# Altium schematic sheet LED_POWER.SchDoc
size A; SheetNumber: 1; SheetTotal: 1
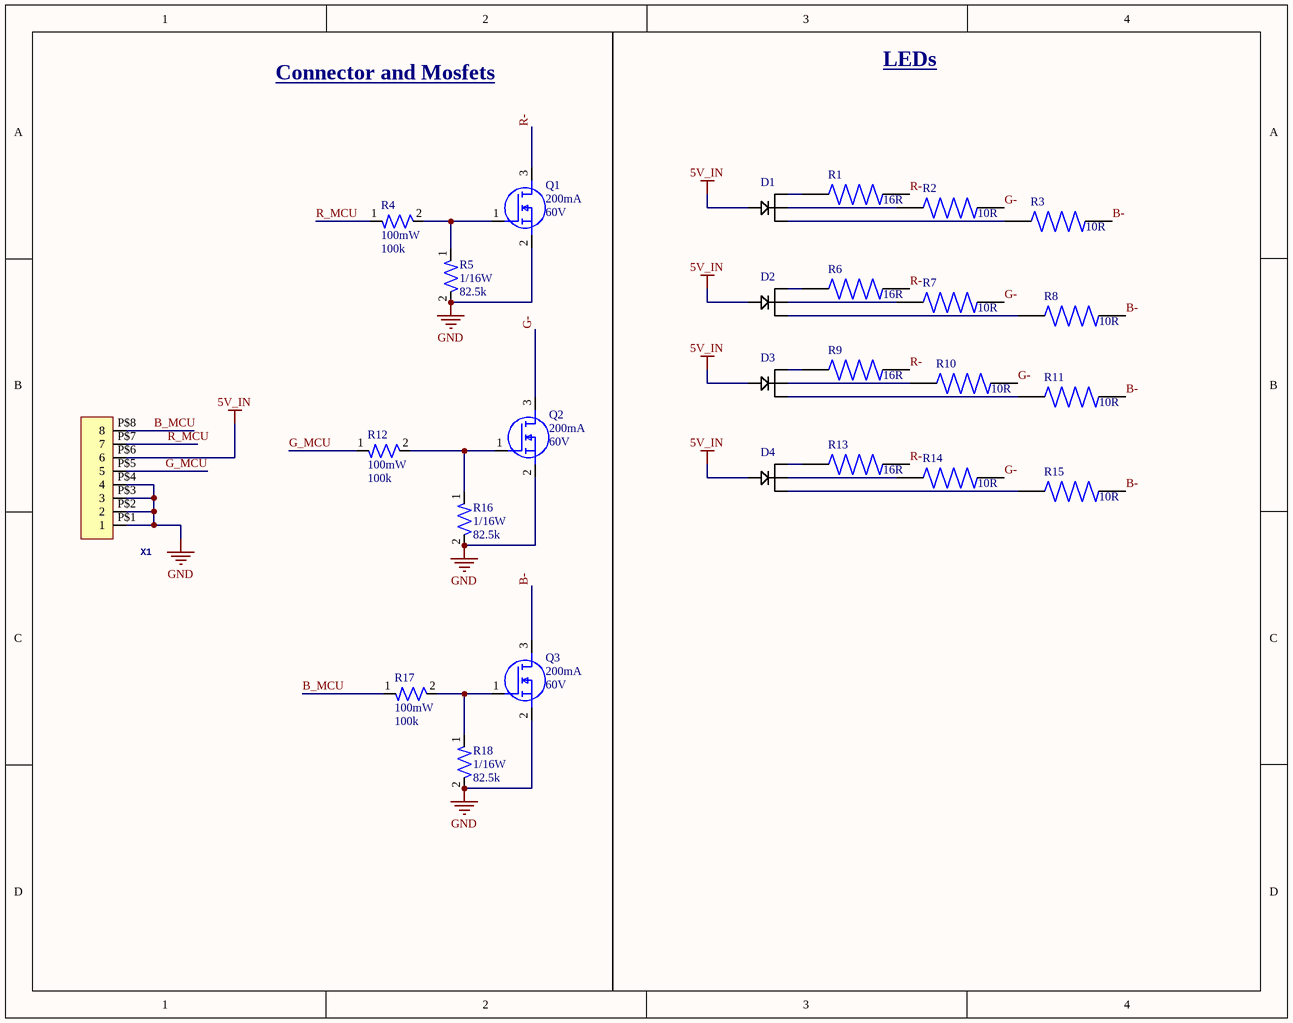
[diagram p0: LED_POWER.SchDoc]

## Parts
D1  FD-9RGB-Y2  [RGBLED pcb]  (value not drawn)
D2  FD-9RGB-Y2  [RGBLED pcb]  (value not drawn)
D3  FD-9RGB-Y2  [RGBLED pcb]  (value not drawn)
D4  FD-9RGB-Y2  [RGBLED pcb]  (value not drawn)
Q1  Continuous Current: 200mA  Voltage: 60V  [IC-SOT23-3]  (hidden comment: T2N7002AK,LM)
Q2  Continuous Current: 200mA  Voltage: 60V  [IC-SOT23-3]  (hidden comment: T2N7002AK,LM)
Q3  Continuous Current: 200mA  Voltage: 60V  [IC-SOT23-3]  (hidden comment: T2N7002AK,LM)
R1  Resistance: 16R  [RES-2512]  (hidden comment: 352116RFT)
R2  Resistance: 10R  [RES-1206]  (hidden comment: CRCW120610R0FKEAHP)
R3  Resistance: 10R  [RES-1206]  (hidden comment: CRCW120610R0FKEAHP)
R4  Power: 100mW  Resistance: 100k  [RES-0603]  (hidden comment: RC0603FR-07100KL)
R5  Power: 1/16W  Resistance: 82.5k  [RES-0402]  (hidden comment: RC0402FR-0782K5L)
R6  Resistance: 16R  [RES-2512]  (hidden comment: 352116RFT)
R7  Resistance: 10R  [RES-1206]  (hidden comment: CRCW120610R0FKEAHP)
R8  Resistance: 10R  [RES-1206]  (hidden comment: CRCW120610R0FKEAHP)
R9  Resistance: 16R  [RES-2512]  (hidden comment: 352116RFT)
R10  Resistance: 10R  [RES-1206]  (hidden comment: CRCW120610R0FKEAHP)
R11  Resistance: 10R  [RES-1206]  (hidden comment: CRCW120610R0FKEAHP)
R12  Power: 100mW  Resistance: 100k  [RES-0603]  (hidden comment: RC0603FR-07100KL)
R13  Resistance: 16R  [RES-2512]  (hidden comment: 352116RFT)
R14  Resistance: 10R  [RES-1206]  (hidden comment: CRCW120610R0FKEAHP)
R15  Resistance: 10R  [RES-1206]  (hidden comment: CRCW120610R0FKEAHP)
R16  Power: 1/16W  Resistance: 82.5k  [RES-0402]  (hidden comment: RC0402FR-0782K5L)
R17  Power: 100mW  Resistance: 100k  [RES-0603]  (hidden comment: RC0603FR-07100KL)
R18  Power: 1/16W  Resistance: 82.5k  [RES-0402]  (hidden comment: RC0402FR-0782K5L)
X1  Molex - Micro-Fit 3.0 Series connector,  3.00mm (0.118") pitch header, 8 positions.  [43045-0800]  (value not drawn)

## Nets
5V_IN: D1.3(B-) D2.3(B-) D3.3(B-) D4.3(B-) X1.P$6(6)
GND: Q1.2(S) Q2.2(S) Q3.2(S) R5.2 R16.2 R18.2 X1.P$1(1) X1.P$2(2) X1.P$3(3) X1.P$4(4)
B-: Q3.3(D) R3.2 R8.2 R11.2 R15.2
B_MCU: R17.1 X1.P$8(8)
G-: Q2.3(D) R2.2 R7.2 R10.2 R14.2
G_MCU: R12.1 X1.P$5(5)
R-: Q1.3(D) R1.2 R6.2 R9.2 R13.2
R_MCU: R4.1 X1.P$7(7)
NetD1_0: D1.0 R3.2
NetD1_1: D1.1(R-) R1.1
NetD1_2: D1.2(G-) R2.1
NetD2_0: D2.0 R8.2
NetD2_1: D2.1(R-) R6.1
NetD2_2: D2.2(G-) R7.1
NetD3_0: D3.0 R11.2
NetD3_1: D3.1(R-) R9.1
NetD3_2: D3.2(G-) R10.1
NetD4_0: D4.0 R15.2
NetD4_1: D4.1(R-) R13.1
NetD4_2: D4.2(G-) R14.1
NetQ1_1: Q1.1(G) R4.2 R5.1
NetQ2_1: Q2.1(G) R12.2 R16.1
NetQ3_1: Q3.1(G) R17.2 R18.1

## Notes on the sheet
- Connector and Mosfets
- LEDs

## Library data of the parts
D1-D4 = 3W-9W RGB LED: https://www.adafruit.com/product/2524#technical-details
Q1-Q3 = NMOS-200MA-0001: MOSFET N-CH 60V 200MA SOT23; ComponentLink1Description: Datasheet; ComponentLink1URL: https://toshiba.semicon-storage.com/info/T2N7002AK_datasheet_en_20150401.pdf?did=29712&prodName=T2N7002AK
R1 R6 R9 R13 = RES-16-0001: 16 Ohms ±1% 2W Chip Resistor 2512 (6332 Metric) Automotive AEC-Q200, Moisture Resistant Thick Film; Package: None; Price: None; Availability: Unavailable; Power: 2W
R2 R3 R7 R8 R10 R11 R14 R15 = RES-10-0001: 10 Ohms ±1% 0.75W, 3/4W Chip Resistor 1206 (3216 Metric) Automotive AEC-Q200, Pulse Withstanding Thick Film; MF: Vishay; SnapEDA: https://www.snapeda.com/parts/CRCW120610R0FKEAHP/Vishay+Dale/view-part/?ref=snap; Package: 3116 Vishay; Check_prices: https://www.snapeda.com/parts/CRCW120610R0FKEAHP/Vishay+Dale/view-part/?ref=eda; Power: 3/4W
R4 R12 R17 = RES-100k-0001: RES SMD 100K OHM 1% 1/10W 0603; Tolerance: 1%; Size: 0603; ComponentLink1Description: Datasheet; ComponentLink1URL: https://www.yageo.com/upload/media/product/products/datasheet/rchip/PYu-RC_Group_51_RoHS_L_12.pdf
R5 R16 R18 = RES-82.5k-0001: 82.5 kOhms ±1% 0.063W, 1/16W Chip Resistor 0402 (1005 Metric) Moisture Resistant Thick Film; Tolerance: 1%; Size: 0603; ComponentLink1Description: Datasheet; ComponentLink1URL: https://www.lcsc.com/datasheet/lcsc_datasheet_2304140030_YAGEO-RC0603FR-0712KL_C114659.pdf
X1 = HEADER_POS8_?43045-0800: GateName_1: G$1; SymbolName_1: HEADER_POS8; DeviceName: 43045-0800; LibraryName: con-molex-micro-fit-3_0_2; DeviceSetName: HEADER_POS8_?; Package: 43045-0800